# Altium schematic sheet transmitter.SchDoc: MW Bench - Transmitter
size A3; Organization: Altium Limited; Address1: L3, 12a Rodborough Rd; Address2: Frenchs Forest; Address3: NSW; Address4: Australia 2086; SheetNumber: 1; SheetTotal: 2
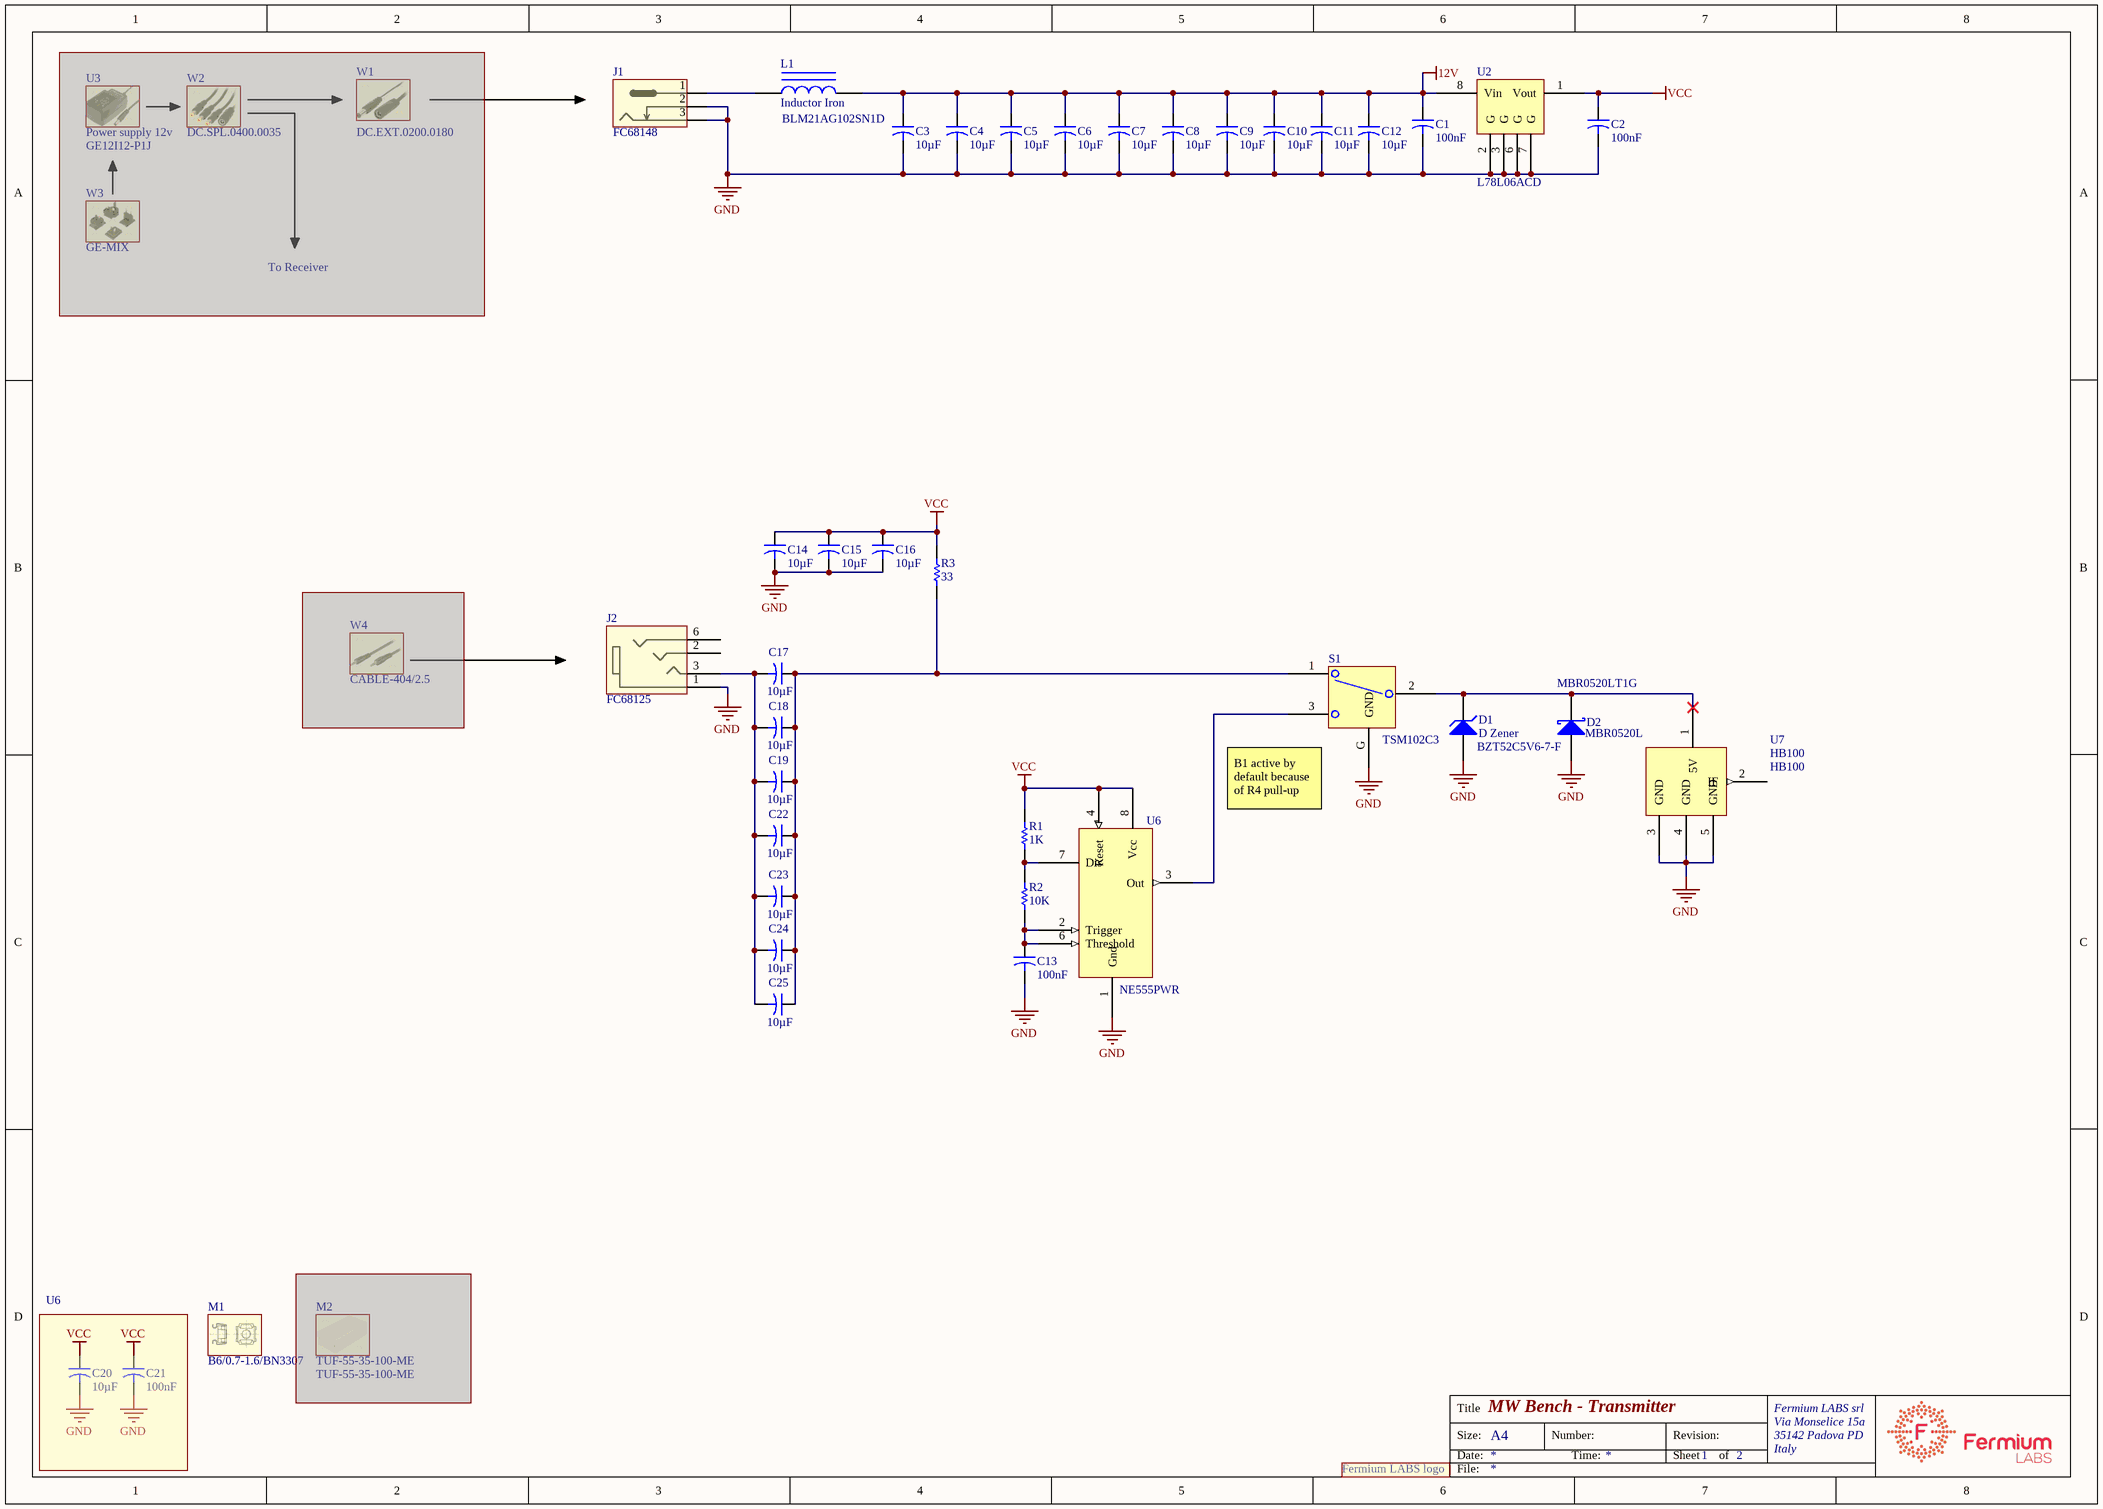
[diagram p0: transmitter.SchDoc]

## Parts
C1  Capacitance: 100nF  [CAP 0805/2012]
C2  Capacitance: 100nF  [CAP 0805/2012]
C3  Capacitance: 10µF  [CAP 1206/3216]
C4  Capacitance: 10µF  [CAP 1206/3216]
C5  Capacitance: 10µF  [CAP 1206/3216]
C6  Capacitance: 10µF  [CAP 1206/3216]
C7  Capacitance: 10µF  [CAP 1206/3216]
C8  Capacitance: 10µF  [CAP 1206/3216]
C9  Capacitance: 10µF  [CAP 1206/3216]
C10  Capacitance: 10µF  [CAP 1206/3216]
C11  Capacitance: 10µF  [CAP 1206/3216]
C12  Capacitance: 10µF  [CAP 1206/3216]
C13  Capacitance: 100nF  [CAP 0805/2012]
C14  Capacitance: 10µF  [CAP 1206/3216]
C15  Capacitance: 10µF  [CAP 1206/3216]
C16  Capacitance: 10µF  [CAP 1206/3216]
C17  Capacitance: 10µF  [CAP 1206/3216]
C18  Capacitance: 10µF  [CAP 1206/3216]
C19  Capacitance: 10µF  [CAP 1206/3216]
C20  Capacitance: 10µF  [CAP 1206/3216]
C21  Capacitance: 100nF  [CAP 0805/2012]
C22  Capacitance: 10µF  [CAP 1206/3216]
C23  Capacitance: 10µF  [CAP 1206/3216]
C24  Capacitance: 10µF  [CAP 1206/3216]
C25  Capacitance: 10µF  [CAP 1206/3216]
D1  D Zener  Supplier Part Number 1: BZT52C5V6-7-F  [SOD123]
D2  Supplier Part Number 1: MBR0520L  Supplier Part Number 2: MBR0520LT1G  [SOD123]
J1  Supplier Part Number 1: FC68148  [dc-jack]  (no BOM)
J2  (no value)  [FC68125]
L1  Inductor Iron  Supplier Part Number 1: BLM21AG102SN1D  [FER 0805/2012]
M1  B6/0.7-1.6/BN3307  (mechanical)
M2  TUF-55-35-100-ME  (mechanical)  (masked out: inside a compile mask, not in the netlist)
R1  value 1K  [RES 0805/2012]  (hidden comment: Res1)
R2  value 10K  [RES 0805/2012]  (hidden comment: Res1)
R3  value 33  [RES 0805/2012]  (hidden comment: Res1)
S1  TSM102C3  [TSM102C3]
U2  L78L06ACD  [ST SOIC-8N]
U3  Power supply 12v  (mechanical)  (masked out: inside a compile mask, not in the netlist)
U6  NE555PWR  [TSSOP8]
U7  HB100  [HB100-buried]
W1  DC.EXT.0200.0180  (mechanical)  (masked out: inside a compile mask, not in the netlist)
W2  DC.SPL.0400.0035  (mechanical)  (masked out: inside a compile mask, not in the netlist)
W3  Worldwide plugs for power supply  (value not drawn)  (mechanical)  (masked out: inside a compile mask, not in the netlist)
W4  CABLE-404/2.5  (mechanical)  (masked out: inside a compile mask, not in the netlist)
XX  fermiumlabs-logo  [frm-med]  (value not drawn)  (no BOM)

## Blocks framed on the sheet
U6: C20 C21

## Nets
12V: C1.1 C3.1 C4.1 C5.1 C6.1 C7.1 C8.1 C9.1 C10.1 C11.1 C12.1 L1.2 U2.8(Vin)
GND: C1.2 C2.2 C3.2 C4.2 C5.2 C6.2 C7.2 C8.2 C9.2 C10.2 C11.2 C12.2 C13.2 C14.2 C15.2 C16.2 C20.2 C21.2 D1.A D2.A J1.2 J1.3 J2.1 S1.G(GND) U2.2(G) U2.3(G) U2.6(G) U2.7(G) U6.1(Gnd) U7.3(GND) U7.4(GND) U7.5(GND)
VCC: C2.1 C14.1 C15.1 C16.1 C20.1 C21.1 R1.2 R3.1 U2.1(Vout) U6.4(Reset) U6.8(Vcc)
NetC13_1: C13.1 R2.1 U6.2(Trigger) U6.6(Threshold)
NetC17_1: C17.1 C18.1 C19.1 C22.1 C23.1 C24.1 C25.1 R3.2 S1.1
NetC17_2: C17.2 C18.2 C19.2 C22.2 C23.2 C24.2 C25.2 J2.3
NetD1_K: D1.K D2.K S1.2 U7.1(5V)
NetJ1_1: J1.1 L1.1
NetR1_1: R1.1 R2.2 U6.7(Dis)
NetS1_3: S1.3 U6.3(Out)

Not connected (* = marked no-connect by the designer): J2 2 6; U7 2(IF)

## Notes on the sheet
- To Receiver
- (near S1) B1 active by default because of R4 pull-up
- Title
- Size:
- Date:
- A4
- Number:
- Time:
- Revision:
- Sheet
- of
- Fermium LABS srl
- Via Monselice 15a
- 35142 Padova PD
- Italy
- File:
- (in symbol fermiumlabs-logo) Fermium LABS logo

## Library data of the parts
C1 C2 C13 C21 = Cap2: Capacitor; Manufacturer: YAGEO; Manufacturer Part Number: CC0805JRX7R9BB104; Unit: pcs; SuppliedAmount: 0; MinAmount: 100; Capacitor type: ceramic; Capacitor kind: MLCC; Operating voltage: 50V; Dielectric: X7R; Tolerance: ±5%; Case - inch: 0805; Case - mm: 2012; Pads: 2 SMD; Supplier 1: TME; Supplier Part Number 1: CC0805JRX7R9104; Category: 0805 MLCC SMD Capacitors; Stock 1: 89911; Pricing 1: 100=0.00613, 300=0.00464, 1000=0.00342, 4000=0.00284, 20000=0.00273 (EUR); Weight: 0.042; Multiples: 100; Mounting: SMD; Price Type: NET; ComponentLink1URL: http://static.tme.eu/products_pics/d/b/b/dbbd93eaf25225110ca26eb66da77328/58538.jpg; ComponentLink1Description: http://static.tme.eu/products_pics/d/b/b/dbbd93eaf25225110ca26eb66da77328/58538.jpg
C3-C12 C14-C20 C22-C25 = Cap2: Capacitor; Manufacturer: SAMSUNG; Manufacturer Part Number: CL31A106KAHNNNE; Unit: pcs; SuppliedAmount: 0; MinAmount: 100; Capacitor type: ceramic; Capacitor kind: MLCC; Operating voltage: 25V; Dielectric: X5R; Tolerance: ±10%; Case - inch: 1206; Case - mm: 3216; Pads: 2 SMD; Published: 23-Sep-2002; PackageReference: CAPR5-4X5; Publisher: Altium Limited; PackageDescription: 1206; Supplier 1: TME; Supplier Part Number 1: CL31A106KAHNNNE; Category: 1206 MLCC SMD Capacitors; Stock 1: 279700; Pricing 1: 100=0.0248, 300=0.0203, 1000=0.0167, 2000=0.0131, 10000=0.0127 (EUR); Weight: 0.061; Multiples: 100; Mounting: SMD; Operating temperature: -55...85°C; Price Type: NET; ComponentLink1URL: http://static.tme.eu/products_pics/b/e/9/be9e0dd298dcf4979ea1dd3d226e0bfa/58780.jpg; ComponentLink1Description: http://static.tme.eu/products_pics/b/e/9/be9e0dd298dcf4979ea1dd3d226e0bfa/58780.jpg
D1 = D Zener: Zener Diode; Manufacturer: Diodes; Max Power Dissipation: 500mW; Zener Voltage: 5.6V; Max Reverse Leakage Current: 1uA; Element Configuration: Single; Tolerance: 7%; Forward Voltage: 900mV; Impedance: 40R; Zener Current: 5mA; Output Current: 50mA; ESD Protection: No; Current: 5A; Supplier 1: TME; Manufacturer Part Number: BZT52C5V6-7-F; Stock 1: 1325; Pricing 1: 25=0.0253, 100=0.0218, 250=0.0175, 1000=0.0163, 3000=0.0153 (USD); Mount: Surface Mount; Number of Pins: 2; Weight: 0.000353oz; Contact Plating: Tin,Matte; Min Operating Temperature: -65°C; Max Operating Temperature: 150°C; Package Quantity: 3000; Packaging: Tape and Reel; Power Dissipation: 500mW; Voltage Tolerance: 7%; Test Current: 5mA; Working Voltage: 5.6V; Peak Reverse Current: 1uA; Termination: SMD/SMT; Power Rating: 500mW; Voltage Rating (DC): 5.6V; Length: 2.85mm; Height: 1.35mm; Width: 1.7mm; Radiation Hardening: No; Lead Free: Lead Free; ComponentLink1URL: https://datasheet.ciiva.com/15142/getdatasheetpartid-75147-15142419.pdf; ComponentLink1Description: https://datasheet.ciiva.com/15142/getdatasheetpartid-75147-15142419.pdf; ComponentLink2URL: https://datasheet.ciiva.com/34302/1539665-34302376.pdf; ComponentLink2Description: https://datasheet.ciiva.com/34302/1539665-34302376.pdf
D2 = D Schottky: Schottky Diode; Manufacturer: FAIRCHILD SEMICONDUCTOR; Unit: pcs; SuppliedAmount: 0; MinAmount: 10; Multiples: 1; Diode type: Schottky rectifying; Off state voltage max.: 20V; Forward voltage at If: 390mV; Load current: 500mA; Pads: 2 SMD; Polarity: Standard; Forward Voltage: 385mV; Max Forward Surge Current (Ifsm): 5.5A; Element Configuration: Single; Peak Reverse Current: 250uA; Published: 8-Jun-2000; LatestRevisionDate: 17-Jul-2002; LatestRevisionNote: Re-released for DXP Platform.; PackageReference: SMB; Publisher: Altium Limited; PackageDescription: DO-214-AA/SMB; 2 C-Bend Leads; Body 5.3 x 3.6 mm, inc. leads (LxW); Code_JEDEC: DO-214-AA; Supplier 1: TME; Manufacturer Part Number: MBR0520L; Category: SMD Schottky Diodes; Stock 1: 24595; Pricing 1: 10=0.0403, 50=0.0376, 250=0.0333, 1000=0.03, 3000=0.0281 (EUR); Weight: 0.032; Case: SOD123; Mounting: SMD; Price Type: NET; ComponentLink1URL: http://static.tme.eu/products_pics/e/d/b/edbd030cb344fc64745afa0f91101952/285567.jpg; ComponentLink1Description: http://static.tme.eu/products_pics/e/d/b/edbd030cb344fc64745afa0f91101952/285567.jpg; Supplier 2: TME; Stock 2: 11077; Pricing 2: 10=0.0667, 50=0.0416, 250=0.0334, 1000=0.03, 3000=0.028 (USD); Case/Package: SOD-123-2; Number of Pins: 2; Contact Plating: Tin,Matte; Min Operating Temperature: -65°C; Max Operating Temperature: 125°C; Packaging: Tape and Reel; Voltage Rating (DC): 20V; Current Rating: 500mA; Output Current: 500mA; Package Quantity: 3000; Average Rectified Current: 500mA; Max Reverse Voltage (DC): 20V; Max Surge Current: 5.5A; Forward Current: 500mA; Max Reverse Leakage Current: 250uA; Max Repetitive Reverse Voltage (Vrrm): 20V; Peak Non-Repetitive Surge Current: 5.5A; Termination: SMD/SMT; Length: 2.69mm; Height: 1.12mm; Width: 1.6mm; Radiation Hardening: No; Lead Free: Lead Free; REACH SVHC: No SVHC; ComponentLink2URL: https://datasheet.ciiva.com/915/mbr0520lt1-d-915488.pdf; ComponentLink2Description: https://datasheet.ciiva.com/915/mbr0520lt1-d-915488.pdf; ComponentLink3URL: https://datasheet.ciiva.com/14168/sy600925-e-14168052.pdf; ComponentLink3Description: https://datasheet.ciiva.com/14168/sy600925-e-14168052.pdf; ComponentLink4URL: https://datasheet.ciiva.com/915/mbr0520lt1-d-915489.pdf; ComponentLink4Description: https://datasheet.ciiva.com/915/mbr0520lt1-d-915489.pdf; ComponentLink5URL: https://datasheet.ciiva.com/915/mbr0520lt1-d-915490.pdf; ComponentLink5Description: https://datasheet.ciiva.com/915/mbr0520lt1-d-915490.pdf; ComponentLink6URL: https://datasheet.ciiva.com/7961/mbr0520lt1-d-7961765.pdf; ComponentLink6Description: https://datasheet.ciiva.com/7961/mbr0520lt1-d-7961765.pdf; ComponentLink7URL: https://datasheet.ciiva.com/25954/mbr0520lt1-d-25954134.pdf; ComponentLink7Description: https://datasheet.ciiva.com/25954/mbr0520lt1-d-25954134.pdf; ComponentLink8URL: https://datasheet.ciiva.com/5762/mbr0520lt1-d-5762889.pdf; ComponentLink8Description: https://datasheet.ciiva.com/5762/mbr0520lt1-d-5762889.pdf; ComponentLink9URL: https://datasheet.ciiva.com/16395/mbr0520lt1-d-16395977.pdf; ComponentLink9Description: https://datasheet.ciiva.com/16395/mbr0520lt1-d-16395977.pdf; ComponentLink10URL: https://datasheet.ciiva.com/16475/mbr0520lt1-d-16475465.pdf; ComponentLink10Description: https://datasheet.ciiva.com/16475/mbr0520lt1-d-16475465.pdf; ComponentLink11URL: https://datasheet.ciiva.com/29886/mbr0520lt1-d-29886377.pdf; ComponentLink11Description: https://datasheet.ciiva.com/29886/mbr0520lt1-d-29886377.pdf; ComponentLink12URL: https://datasheet.ciiva.com/7962/mbr0520lt1-d-7962698.pdf; ComponentLink12Description: https://datasheet.ciiva.com/7962/mbr0520lt1-d-7962698.pdf; ComponentLink13URL: https://datasheet.ciiva.com/14559/70099495-14559898.pdf; ComponentLink13Description: https://datasheet.ciiva.com/14559/70099495-14559898.pdf; ComponentLink14URL: https://datasheet.ciiva.com/5762/mbr0520lt1-d-5762891.pdf; ComponentLink14Description: https://datasheet.ciiva.com/5762/mbr0520lt1-d-5762891.pdf; ComponentLink15URL: https://datasheet.ciiva.com/7962/mbr0520lt1-d-7962699.pdf; ComponentLink15Description: https://datasheet.ciiva.com/7962/mbr0520lt1-d-7962699.pdf; ComponentLink16URL: https://datasheet.ciiva.com/4714/mbr0520lt1-d-94265-4714156.pdf; ComponentLink16Description: https://datasheet.ciiva.com/4714/mbr0520lt1-d-94265-4714156.pdf
J1 = jackdc: Manufacturer: CLIFF; Manufacturer Part Number: DC-10A FC68148; Unit: pcs; SuppliedAmount: 0; MinAmount: 1; Connector: socket; Connector type: DC supply; Contact size: 5,5/2,1mm; Plug outside diameter: 5.5mm; Plug inside diameter: 2.1mm; Connector variant: with on/off switch; Electrical mounting: soldering; Rated current: 5A; Rated voltage: 12V DC; Spatial orientation: angled 90°; Pads: 3 THT; Supplier 1: TME; Category: DC power connectors; Stock 1: 20287; Pricing 1: 1=0.4194, 20=0.3065, 100=0.2581, 500=0.2258 (USD); Weight: 1.733; Multiples: 1; Package type: in bulk; Price Type: NET; ComponentLink1URL: http://static.tme.eu/products_pics/f/8/e/f8eb2e1bea4ffe6692f5958f8ef9edd4/323250.jpg; ComponentLink1Description: http://static.tme.eu/products_pics/f/8/e/f8eb2e1bea4ffe6692f5958f8ef9edd4/323250.jpg
J2 = FC68125: Manufacturer: CLIFF; Unit: pcs; SuppliedAmount: 0; MinAmount: 2; Multiples: 1; Connector: socket; Connector type: Jack 3,5mm; Number of ways: 4; Electrical mounting: THT; Pads: 5 THT; Supplier 1: TME; Supplier Part Number 1: FC68125; Manufacturer Part Number: FC68125; Category: Jack connectors; Stock 1: 1312; Pricing 1: 2=0.41, 20=0.37, 100=0.33, 500=0.28 (USD); Weight: 0.942; Width: 7.1mm; Height: 6mm; Depth: 15.1mm; Price Type: NET; ComponentLink1URL: http://static.tme.eu/products_pics/9/3/a/93a060f269bb569398921100f84c519a/360179.jpg; ComponentLink1Description: http://static.tme.eu/products_pics/9/3/a/93a060f269bb569398921100f84c519a/360179.jpg
L1 = Inductor Iron: Magnetic-Core Inductor; Manufacturer: Murata; Core Material: Ferrite; Material: Steel,Ferrite; Impedance: 1KR; Tolerance: 25%; Max DC Current: 200mA; DC Resistance (DCR): 280mR; Max Current Rating: 600mA; Current Rating: 500mA; Test Frequency: 100MHz; Number of Lines: 1; Shielding: Unshielded; Supplier 1: TME; Manufacturer Part Number: BLM21AG102SN1D; Stock 1: 53975; Pricing 1: 25=0.068, 100=0.0551, 1000=0.0451, 4000=0.0397 (USD); Case/Package: 0805; Number of Pins: 2; Weight: 0.000194oz; Case Code (Metric): 2012; Case Code (Imperial): 0805; Min Operating Temperature: -55°C; Max Operating Temperature: 125°C; Package Quantity: 1; Packaging: Tape and Reel; Termination: SMD/SMT; DC Current: 200mA; Military Standard: Not; Frequency: 100MHz; Number of Circuits: 1; Length: 2mm; Height: 0.85mm; Depth: 1.25mm; Width: 1.25mm; Radiation Hardening: No; REACH SVHC: No SVHC; Lead Free: Lead Free; ComponentLink1URL: https://datasheet.ciiva.com/19454/1845136-19454717.pdf; ComponentLink1Description: https://datasheet.ciiva.com/19454/1845136-19454717.pdf; ComponentLink2URL: https://datasheet.ciiva.com/18093/getdatasheetpartid-139643-18093010.pdf; ComponentLink2Description: https://datasheet.ciiva.com/18093/getdatasheetpartid-139643-18093010.pdf; ComponentLink3URL: https://datasheet.ciiva.com/29347/442432-da-01-en-chip-drossel-0805-1000r-200ma-2-0x1-25mm-29347996.pdf; ComponentLink3Description: https://datasheet.ciiva.com/29347/442432-da-01-en-chip-drossel-0805-1000r-200ma-2-0x1-25mm-29347996.pdf; ComponentLink4URL: https://datasheet.ciiva.com/41449/001172322-da-01-en-drossel-0805-1000r-2-0x1-25mm-4000st-41449636.pdf; ComponentLink4Description: https://datasheet.ciiva.com/41449/001172322-da-01-en-drossel-0805-1000r-2-0x1-25mm-4000st-41449636.pdf; ComponentLink5URL: https://datasheet.ciiva.com/6212/l0110s0100blm21a-6212318.pdf; ComponentLink5Description: https://datasheet.ciiva.com/6212/l0110s0100blm21a-6212318.pdf; ComponentLink6URL: https://datasheet.ciiva.com/16286/l0110s0100blm21a-16286461.pdf; ComponentLink6Description: https://datasheet.ciiva.com/16286/l0110s0100blm21a-16286461.pdf; ComponentLink7URL: https://datasheet.ciiva.com/8021/l0110s0100blm21a-8021550.pdf; ComponentLink7Description: https://datasheet.ciiva.com/8021/l0110s0100blm21a-8021550.pdf; ComponentLink8URL: https://datasheet.ciiva.com/8021/l0110s0100blm21a-8021548.pdf; ComponentLink8Description: https://datasheet.ciiva.com/8021/l0110s0100blm21a-8021548.pdf; ComponentLink9URL: https://datasheet.ciiva.com/3081/l0110s0100blm21a-3081640.pdf; ComponentLink9Description: https://datasheet.ciiva.com/3081/l0110s0100blm21a-3081640.pdf; ComponentLink10URL: https://datasheet.ciiva.com/25903/l0110s0100blm21a-25903493.pdf; ComponentLink10Description: https://datasheet.ciiva.com/25903/l0110s0100blm21a-25903493.pdf; ComponentLink11URL: https://datasheet.ciiva.com/3082/l0110s0100blm21a-3082728.pdf; ComponentLink11Description: https://datasheet.ciiva.com/3082/l0110s0100blm21a-3082728.pdf; ComponentLink12URL: https://datasheet.ciiva.com/6212/l0110s0100blm21a-6212347.pdf; ComponentLink12Description: https://datasheet.ciiva.com/6212/l0110s0100blm21a-6212347.pdf; ComponentLink13URL: https://datasheet.ciiva.com/6212/l0110s0100blm21a-6212345.pdf; ComponentLink13Description: https://datasheet.ciiva.com/6212/l0110s0100blm21a-6212345.pdf
R1 = Res1: Resistor; Manufacturer: Royal Electronic Factory; Manufacturer Part Number: 0805S8J0102T5E; Supplier 1: TME; Supplier Part Number 1: SMD0805-1K; Stock 1: 2713700; Pricing 1: 100=0.0062, 1000=0.0024, 5000=0.0008, 15000=0.0008, 50000=0.0008 (USD)
R2 = Res1: Resistor; Manufacturer: Royal Electronic Factory; Manufacturer Part Number: 0805S8J0103T5E; Supplier 1: TME; Supplier Part Number 1: SMD0805-10K; Stock 1: 1600500; Pricing 1: 100=0.0065, 1000=0.0023, 5000=0.0008, 15000=0.0008, 50000=0.0008 (USD)
R3 = Res1: Resistor; Manufacturer: Yageo; Manufacturer Part Number: RC0805JR-0733RL; Tolerance: 5%; Resistance: 33R; Temperature Coefficient: 100ppm/°C; Power Rating: 125mW; Voltage Rating: 150V; Supplier 1: TME; Supplier Part Number 1: RC0805JR-0733R; Stock 1: 2800; Pricing 1: 100=0.0052, 1000=0.0031, 5000=0.001, 15000=0.001, 50000=0.0008 (USD); Case/Package: 0805; Weight: 0.000194oz; Contact Plating: Tin,Lead,Matte; Case Code (Imperial): 0805; Case Code (Metric): 2012; Min Operating Temperature: -55°C; Max Operating Temperature: 155°C; Composition: Thick Film; Packaging: Tape and Reel; Military Standard: Not; Termination: SMD/SMT; Length: 2mm; Height: 0.5mm; Width: 1.25mm; Depth: 1.25mm; Radiation Hardening: No; REACH SVHC: Unknown; Lead Free: Lead Free; ComponentLink1URL: https://datasheet.ciiva.com/7941/442941-7941948.pdf; ComponentLink1Description: https://datasheet.ciiva.com/7941/442941-7941948.pdf; ComponentLink2URL: https://datasheet.ciiva.com/7941/442941-7941947.pdf; ComponentLink2Description: https://datasheet.ciiva.com/7941/442941-7941947.pdf; ComponentLink3URL: https://datasheet.ciiva.com/17053/rc0805-17053447.pdf; ComponentLink3Description: https://datasheet.ciiva.com/17053/rc0805-17053447.pdf
U3 = GE12I12-P1J: Supplier 1: TME; Supplier Part Number 1: GE12I12-P1J
U7 = HB100: Manufacturer: China unspecified; Manufacturer Part Number: HB100; Supplier 1: Alibaba; Supplier Part Number 1: HB100
W3 = GE-MIX: Supplier 1: TME; Supplier Part Number 1: GE-MIX
M1 = B6/0.7-1.6/BN3307: Supplier 1: TME; Supplier Part Number 1: B6/0.7-1.6/BN3307
M2 = TUF-55-35-100-ME: Supplier 1: TME; Supplier Part Number 1: TUF-55-35-100-ME
S1 = TSM102C3: Supplier 1: TME; Supplier Part Number 1: TSM102C3
U2 = L78L06ACD: Supplier 1: TME; Supplier Part Number 1: L78L06ACD
U6 = NE555PWR: Supplier 1: TME; Supplier Part Number 1: NE555PWR
W1 = DC.EXT.0200.0180: Supplier 1: TME; Supplier Part Number 1: DC.EXT.0200.0180
W2 = DC.SPL.0400.0035: Supplier 1: TME; Supplier Part Number 1: DC.SPL.0400.0035
W4 = CABLE-404/2.5: Supplier 1: TME; Supplier Part Number 1: CABLE-404/2.5